# EAGLE design pga460_transformer (EAGLE 9.4.2)
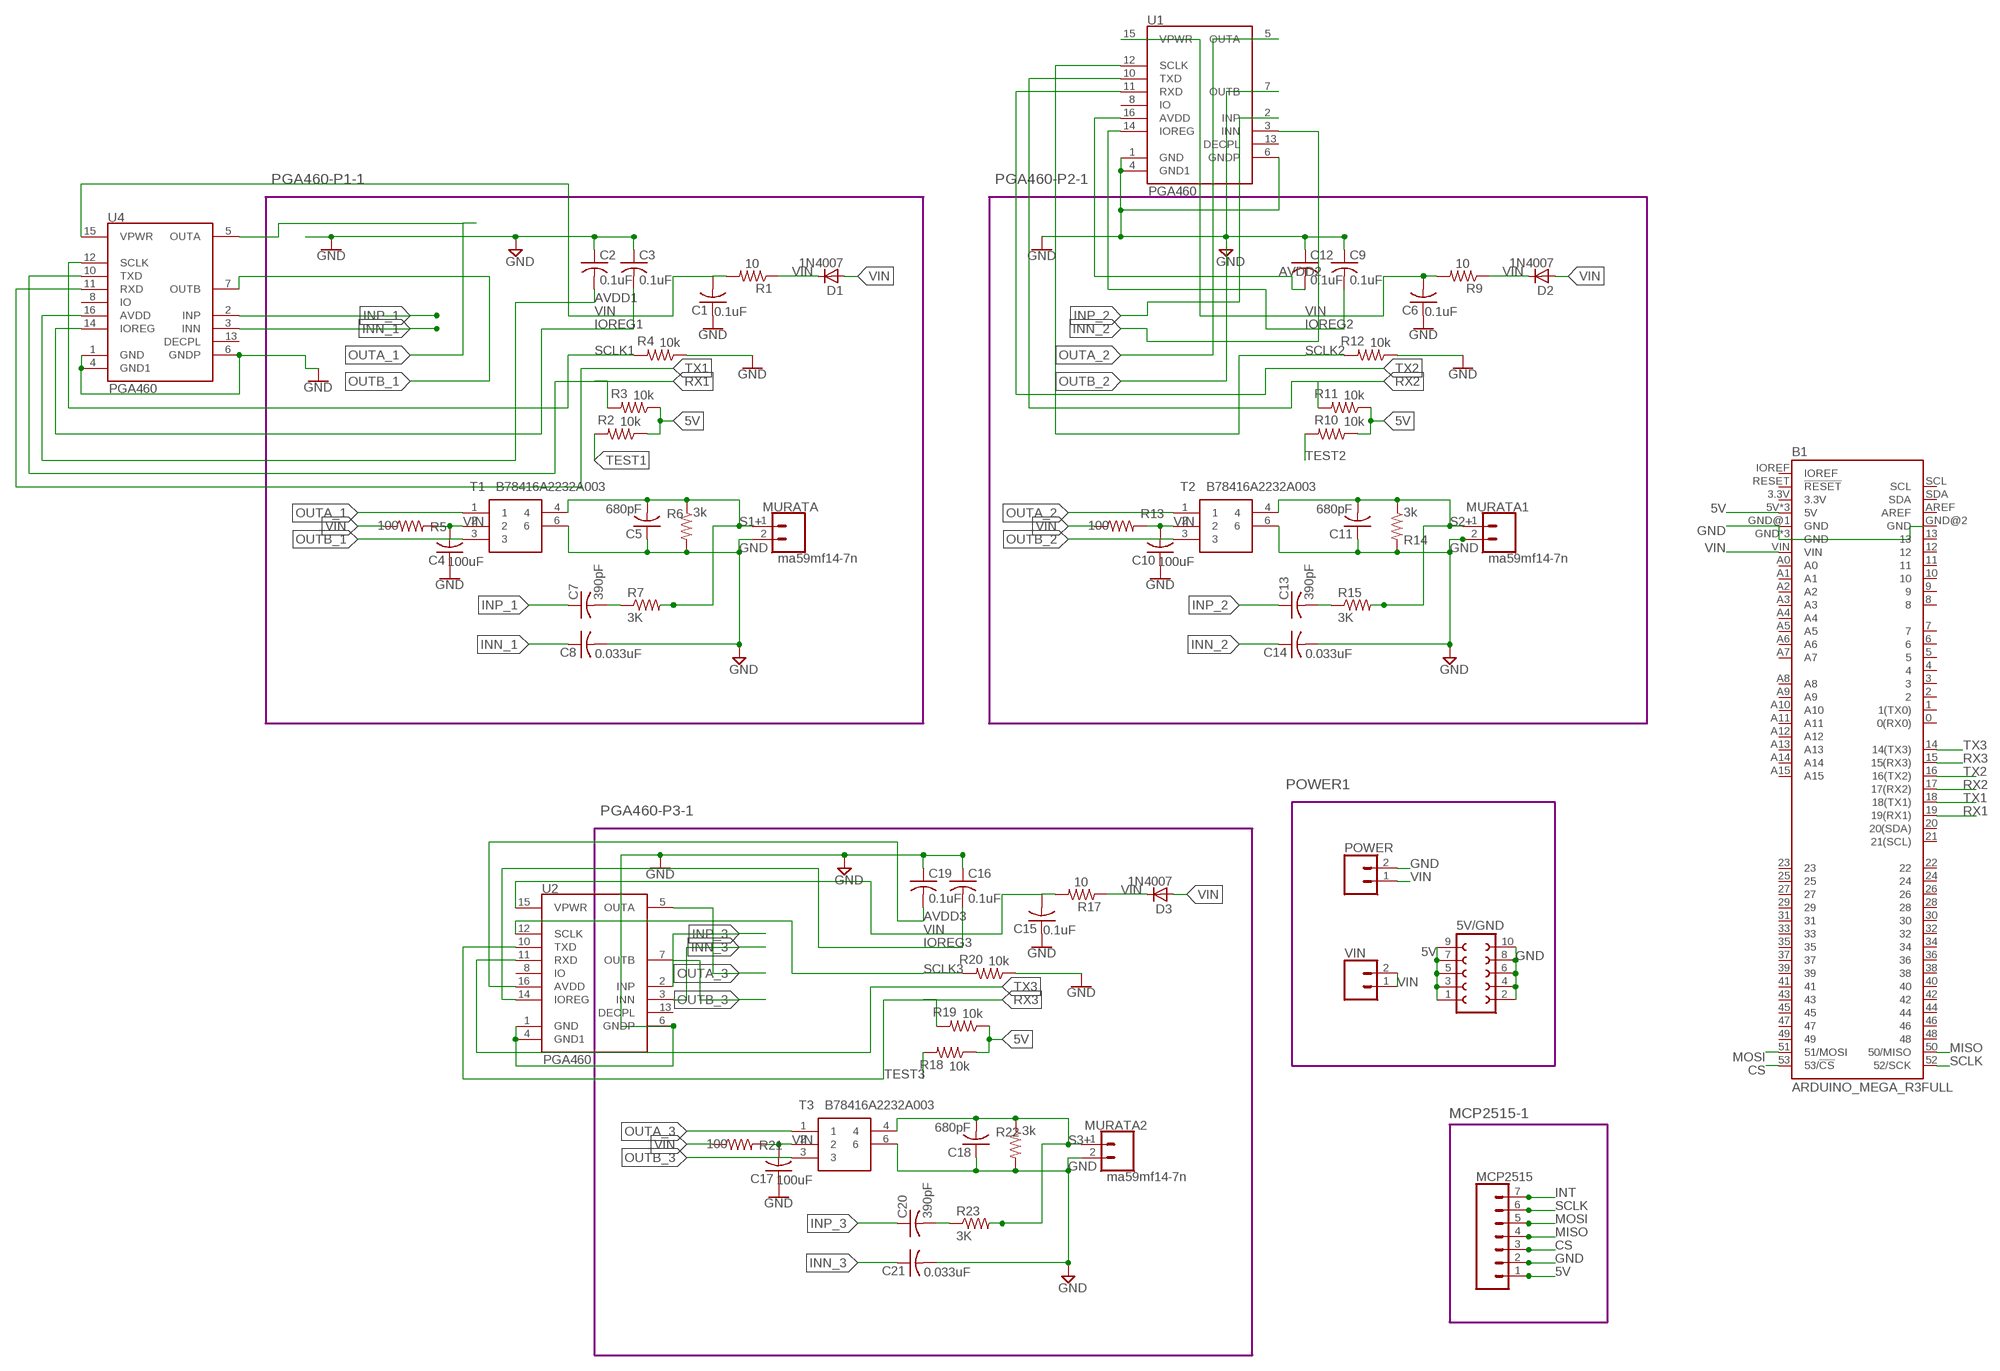
[diagram p0: schematic, sheet 1]

## Parts
5V/GND  FE05-2  [FE05-2]
B1  ARDUINO_MEGA_R3FULL  [ARDUINO_MEGA_NO_SILK]
C1  0.1uF  C-USC0805  [C0805]
C2  0.1uF  C-USC0805  [C0805]
C3  0.1uF  C-USC0805  [C0805]
C4  100uF  C-USC0805  [C0805]
C5  680pF  C-USC0805  [C0805]
C6  0.1uF  C-USC0805  [C0805]
C7  390pF  C-USC0805  [C0805]
C8  0.033uF  C-USC0805  [C0805]
C9  0.1uF  C-USC0805  [C0805]
C10  100uF  C-USC0805  [C0805]
C11  680pF  C-USC0805  [C0805]
C12  0.1uF  C-USC0805  [C0805]
C13  390pF  C-USC0805  [C0805]
C14  0.033uF  C-USC0805  [C0805]
C15  0.1uF  C-USC0805  [C0805]
C16  0.1uF  C-USC0805  [C0805]
C17  100uF  C-USC0805  [C0805]
C18  680pF  C-USC0805  [C0805]
C19  0.1uF  C-USC0805  [C0805]
C20  390pF  C-USC0805  [C0805]
C21  0.033uF  C-USC0805  [C0805]
D1  1N4007  [SMA]
D2  1N4007  [SMA]
D3  1N4007  [SMA]
MCP2515  CONN_07  [1X07]
MURATA  ma59mf14-7n  CONN_02  [1X02]
MURATA1  ma59mf14-7n  CONN_02  [1X02]
MURATA2  ma59mf14-7n  CONN_02  [1X02]
POWER  CONN_02  [1X02]
R1  10  R-US_R0805  [R0805]
R2  10k  R-US_R0805  [R0805]
R3  10k  R-US_R0805  [R0805]
R4  10k  R-US_R0805  [R0805]
R5  100  R-US_R0805  [R0805]
R6  3k  R-US_R0805  [R0805]
R7  3K  R-US_M0805  [M0805]
R9  10  R-US_R0805  [R0805]
R10  10k  R-US_R0805  [R0805]
R11  10k  R-US_R0805  [R0805]
R12  10k  R-US_R0805  [R0805]
R13  100  R-US_R0805  [R0805]
R14  3k  R-US_R0805  [R0805]
R15  3K  R-US_M0805  [M0805]
R17  10  R-US_R0805  [R0805]
R18  10k  R-US_R0805  [R0805]
R19  10k  R-US_R0805  [R0805]
R20  10k  R-US_R0805  [R0805]
R21  100  R-US_R0805  [R0805]
R22  3k  R-US_R0805  [R0805]
R23  3K  R-US_M0805  [M0805]
T1  B78416A2232A003  [B78416A2232A003]
T2  B78416A2232A003  [B78416A2232A003]
T3  B78416A2232A003  [B78416A2232A003]
U1  PGA460  [TSSOP16]
U2  PGA460  [TSSOP16]
U4  PGA460  [TSSOP16]
VIN  CONN_02  [1X02]

## Module instances
PGA460-P1-1 = PGA460-P1
PGA460-P2-1 = PGA460-P2
PGA460-P3-1 = PGA460-P3
POWER1 = POWER
MCP2515-1 = MCP2515

## Nets
5V: 5V/GND.1 5V/GND.3 5V/GND.5 5V/GND.7 5V/GND.9 B1.5V B1.5V@1(5V) B1.5V@2(5V) MCP2515.1 R2.1 R3.1 R10.1 R11.1 R18.1 R19.1
AVDD1: C2.2 U4.16(AVDD)
AVDD2: C12.2 U1.16(AVDD)
AVDD3: C19.2 U2.16(AVDD)
CS: B1.53(53/!CS) MCP2515.3
GND: 5V/GND.2 5V/GND.4 5V/GND.6 5V/GND.8 5V/GND.10 B1.GND B1.GND@1(GND) B1.GND@3(GND) B1.GND@4(GND) C1.1 C2.1 C3.1 C4.1 C5.1 C6.1 C8.2 C9.1 C10.1 C11.1 C12.1 C14.2 C15.1 C16.1 C17.1 C18.1 C19.1 C21.2 MCP2515.2 MURATA1.2 MURATA2.2 MURATA.2 POWER.2 R4.1 R6.2 R12.1 R14.2 R20.1 R22.2 T1.6 T2.6 T3.6 U1.1(GND) U1.4(GND1) U1.6(GNDP) U2.1(GND) U2.4(GND1) U2.6(GNDP) U4.1(GND) U4.4(GND1) U4.6(GNDP)
INN_1: C8.1 U4.3(INN)
INN_2: C14.1 U1.3(INN)
INN_3: C21.1 U2.3(INN)
INP_1: C7.1 U4.2(INP)
INP_2: C13.1 U1.2(INP)
INP_3: C20.1 U2.2(INP)
INT: MCP2515.7
IOREG1: C3.2 U4.14(IOREG)
IOREG2: C9.2 U1.14(IOREG)
IOREG3: C16.2 U2.14(IOREG)
MISO: B1.50(50/MISO) MCP2515.4
MOSI: B1.51(51/MOSI) MCP2515.5
N$10: C7.2 R7.1
N$12: C13.2 R15.1
N$18: C20.2 R23.1
OUTA_1: T1.1 U4.5(OUTA)
OUTA_2: T2.1 U1.5(OUTA)
OUTA_3: T3.1 U2.5(OUTA)
OUTB_1: T1.3 U4.7(OUTB)
OUTB_2: T2.3 U1.7(OUTB)
OUTB_3: T3.3 U2.7(OUTB)
RX1: B1.19(19(RX1)) R3.2 U4.10(TXD)
RX2: B1.17(17(RX2)) R11.2 U1.10(TXD)
RX3: B1.15(15(RX3)) R19.2 U2.10(TXD)
S1+: C5.2 MURATA.1 R6.1 R7.2 T1.4
S2+: C11.2 MURATA1.1 R14.1 R15.2 T2.4
S3+: C18.2 MURATA2.1 R22.1 R23.2 T3.4
SCLK: B1.52(52/SCK) MCP2515.6
SCLK1: R4.2 U4.12(SCLK)
SCLK2: R12.2 U1.12(SCLK)
SCLK3: R20.2 U2.12(SCLK)
TEST1: R2.2
TEST2: R10.2
TEST3: R18.2
TX1: B1.18(18(TX1)) U4.11(RXD)
TX2: B1.16(16(TX2)) U1.11(RXD)
TX3: B1.14(14(TX3)) U2.11(RXD)
VIN: B1.VIN C1.2 C4.2 C6.2 C10.2 C15.2 C17.2 D1.A D1.K(C) D2.A D2.K(C) D3.A D3.K(C) POWER.1 R1.1 R1.2 R5.1 R5.2 R9.1 R9.2 R13.1 R13.2 R17.1 R17.2 R21.1 R21.2 T1.2 T2.2 T3.2 U1.15(VPWR) U2.15(VPWR) U4.15(VPWR) VIN.1 VIN.2
Unconnected: B1.0(0(RX0)) B1.1(1(TX0)) B1.2 B1.3 B1.3.3V B1.4 B1.5 B1.6 B1.7 B1.8 B1.9 B1.10 B1.11 B1.12 B1.13 B1.20(20(SDA)) B1.21(21(SCL)) B1.22 B1.23 B1.24 B1.25 B1.26 B1.27 B1.28 B1.29 B1.30 B1.31 B1.32 B1.33 B1.34 B1.35 B1.36 B1.37 B1.38 B1.39 B1.40 B1.41 B1.42 B1.43 B1.44 B1.45 B1.46 B1.47 B1.48 B1.49 B1.A0 B1.A1 B1.A2 B1.A3 B1.A4 B1.A5 B1.A6 B1.A7 B1.A8 B1.A9 B1.A10 B1.A11 B1.A12 B1.A13 B1.A14 B1.A15 B1.AREF B1.GND@2(GND) B1.IOREF B1.RESET(!RESET) B1.SCL B1.SDA U1.8(IO) U1.13(DECPL) U2.8(IO) U2.13(DECPL) U4.8(IO) U4.13(DECPL)

## Library data of the parts
5V/GND = con-lsta:FE05-2: FEMALE HEADER; OC_FARNELL: unknown; OC_NEWARK: unknown
B1 = SparkFun-Boards:ARDUINO_MEGA_R3: Arduino Mega R3 ATmega2560 R3 compatible footprint. SparkFun Products: Arduino Mega 2560 R3 <https://www.sparkfun.com/products/11061>
C1-C21 = adafruit:C-US: CAPACITOR, American symbol
D1-D3 = casovac:1N4007
MCP2515 = SparkFun-Connectors:CONN_07: Multi connection point. Often used as Generic Header-pin footprint for 0.1 inch spaced/style header connections On any of the 0.1 inch spaced packages, you can populate with these: Break Away Headers - Straight <https://www.sparkfun.com/products/116> (PRT-00116) Break Away Male Headers - Right Angle <https://www.sparkfun.com/products/553> (PRT-00553) Female Headers <https://www.sparkfun.com/products/115> (PRT-00115) Break Away Headers - Machine Pin <https://www.sparkfun.com/products/117> (PRT-00117) Break Away Female Headers - Swiss Machine Pin <https://www.sparkfun.com/products/743> (PRT-00743) For SCREWTERMINALS and SPRING TERMINALS visit here: Screw Terimnals on SparkFun.com <https://www.sparkfun.com/search/results?term=Screw+Terminals> (5mm/3.5mm/2.54mm spacing) This device is also useful as a general connection point to wire up your design to another part of your project. Our various solder wires solder well into these plated through hole pads. Hook-Up Wire - Assortment (Stranded, 22 AWG) <https://www.sparkfun.com/products/11375> (PRT-11375) Hook-Up Wire - Assortment (Solid Core, 22 AWG) <https://www.sparkfun.com/products/11367> (PRT-11367) View the entire wire category on our website here <https://www.sparkfun.com/categories/141> Special notes: Molex polarized connector foot print use with SKU : PRT-08231 with associated crimp pins and housings. 1MM SMD Version SKU: PRT-10208 NOTES ON THE VARIANTS LOCK and LOCK_LONGPADS... This footprint was designed to help hold the alignment of a through-hole component (i.e. 6-pin header) while soldering it into place. You may notice that each hole has been shifted either up or down by 0.005 of an inch from it's more standard position (which is a perfectly straight line). This slight alteration caused the pins (the squares in the middle) to touch the edges of the holes. Because they are alternating, it causes a "brace" to hold the component in place. 0.005 has proven to be the perfect amount of "off-center" position when using our standard breakaway headers. Although looks a little odd when you look at the bare footprint, once you have a header in there, the alteration is very hard to notice. Also,if you push a header all the way into place, it is covered up entirely on the bottom side.
MURATA MURATA1 MURATA2 POWER VIN = SparkFun-Connectors:CONN_02: Multi connection point. Often used as Generic Header-pin footprint for 0.1 inch spaced/style header connections On any of the 0.1 inch spaced packages, you can populate with these: Break Away Headers - Straight <https://www.sparkfun.com/products/116> (PRT-00116) Break Away Male Headers - Right Angle <https://www.sparkfun.com/products/553> (PRT-00553) Female Headers <https://www.sparkfun.com/products/115> (PRT-00115) Break Away Headers - Machine Pin <https://www.sparkfun.com/products/117> (PRT-00117) Break Away Female Headers - Swiss Machine Pin <https://www.sparkfun.com/products/743> (PRT-00743) For SCREWTERMINALS and SPRING TERMINALS visit here: Screw Terimnals on SparkFun.com <https://www.sparkfun.com/search/results?term=Screw+Terminals> (5mm/3.5mm/2.54mm spacing) This device is also useful as a general connection point to wire up your design to another part of your project. Our various solder wires solder well into these plated through hole pads. Hook-Up Wire - Assortment (Stranded, 22 AWG) <https://www.sparkfun.com/products/11375> (PRT-11375) Hook-Up Wire - Assortment (Solid Core, 22 AWG) <https://www.sparkfun.com/products/11367> (PRT-11367) View the entire wire category on our website here <https://www.sparkfun.com/categories/141> Special notes: Molex polarized connector foot print use with: PRT-08233 with associated crimp pins and housings. 2.54_SCREWTERM for use with PRT-10571. 3.5mm Screw Terminal footprints for PRT-08084 5mm Screw Terminal footprints for use with PRT-08432
R1-R6 R9-R14 R17-R22 = adafruit:R-US_: RESISTOR, American symbol
R7 R15 R23 = rcl:R-US_: RESISTOR, American symbol; SPICEPREFIX: R
T1-T3 = SamacSys_Parts:B78416A2232A003: Current Transformers 3mH 52KHz 200Vac XFMR Ultrasonic Snsr Source: Datasheet <https://componentsearchengine.com/Datasheets/1/B78416A2232A003.pdf>; DESCRIPTION: Current Transformers 3mH 52KHz 200Vac XFMR Ultrasonic Snsr; HEIGHT: 7.1mm; MANUFACTURER_NAME: EPCOS; MANUFACTURER_PART_NUMBER: B78416A2232A003; MOUSER_PART_NUMBER: 871-B78416A2232A003; MOUSER_PRICE-STOCK: https://www.mouser.com/Search/Refine.aspx?Keyword=871-B78416A2232A003
U1 U2 U4 = texas:PGA460: PGA460 Ultrasonic Signal Processor and Transducer Driver

## Module PGA460-P1
Ports: 

### Library data of the parts

## Module PGA460-P2
Ports: 

### Library data of the parts

## Module PGA460-P3
Ports: 

### Library data of the parts

## Module POWER
Ports: 

### Library data of the parts

## Module MCP2515
Ports: 

### Library data of the parts

## Board
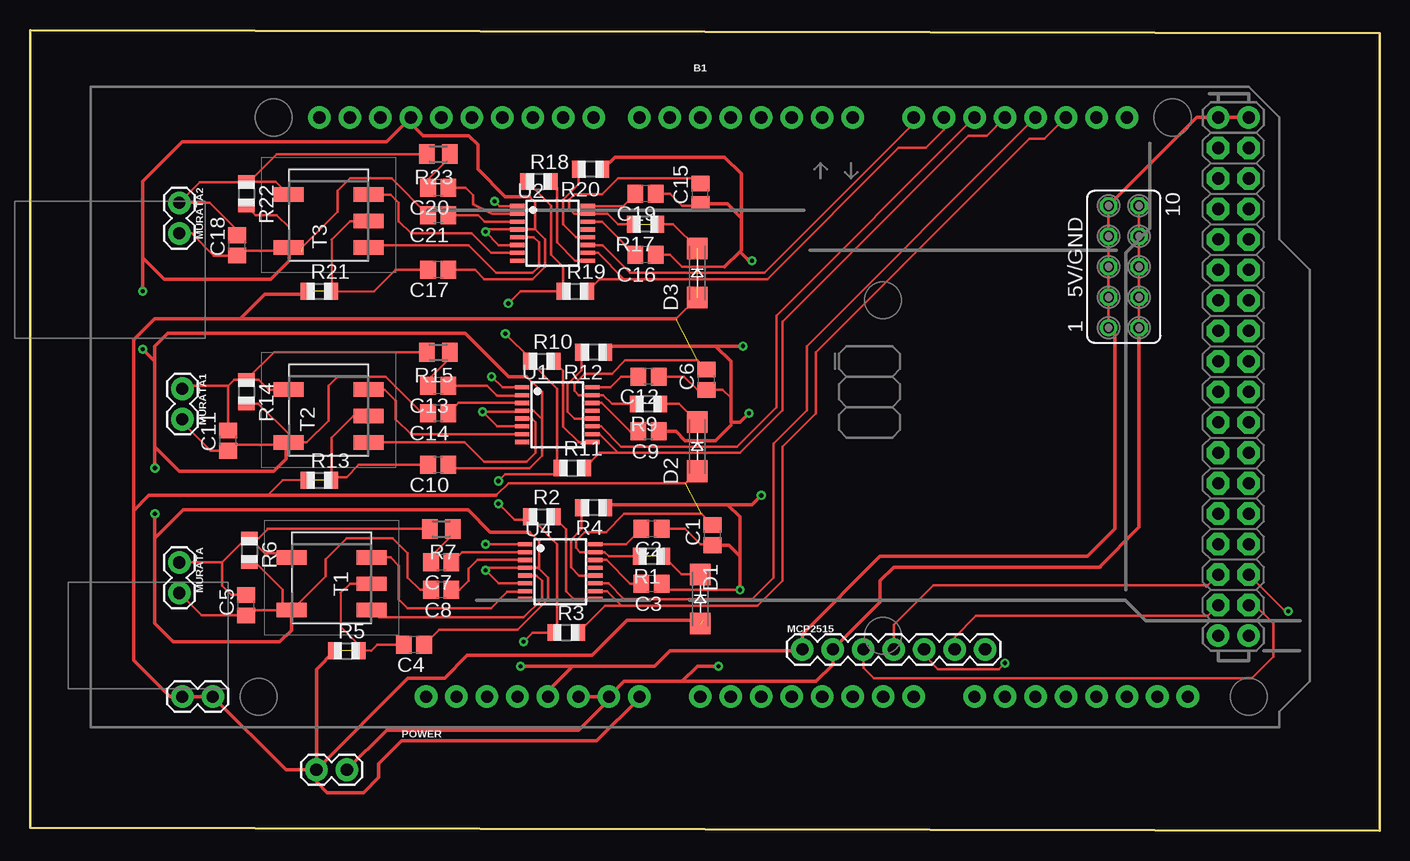
[diagram p1: board, top side]
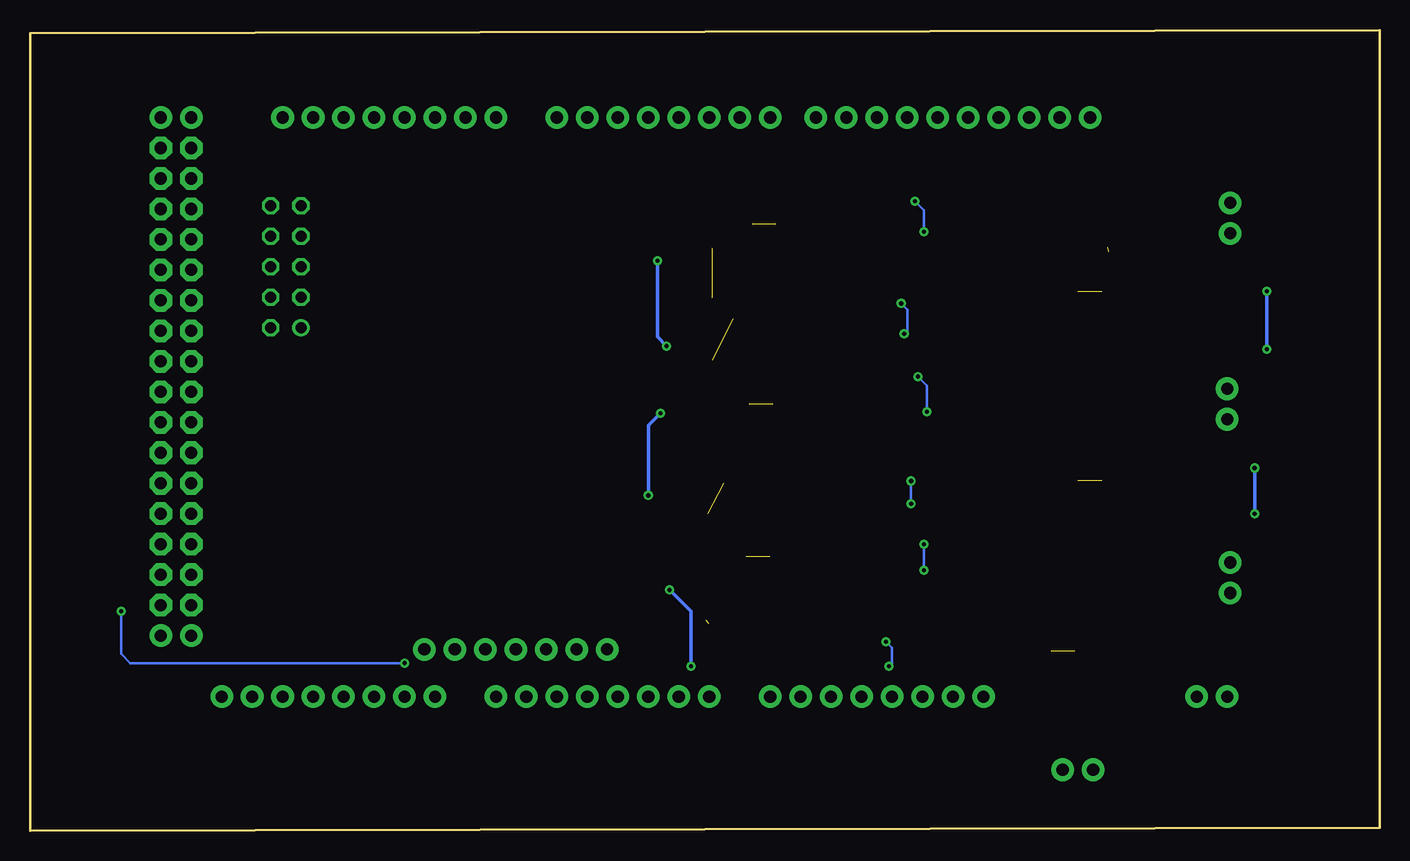
[diagram p2: board, bottom side, seen from below]

Size 112.5 x 66.73 mm. Coordinates in mm from the lower left corner, seen from the top.
Outline: 0,0.25 112.5,0 112.5,66.47 0,66.73 0,0.25
Copper layers (1*16): Top 0.035mm / dielectric 1.5mm / Bottom 0.035mm
Design rules "default": minimum track width 6mil, minimum drill 0.35mm, track to track 6mil, track to pad 6mil, pad to pad 6mil, via to via 6mil, smd to smd 6mil, copper to edge 40mil, drill to drill 6mil, minimum pad ring 10mil, minimum via ring 8mil, stop-mask expansion 4mil, vias tented up to drill 0mil, thermal gap 10mil

### Footprints (pad centres in the part's own frame; a part is rotated, then mirrored left to right if it is on the bottom)
FE05-2 = drill 0.914: 1 -5.08,1.27 | drill 0.914 octagon: 2 -5.08,-1.27; 3 -2.54,1.27; 4 -2.54,-1.27; 5 0,1.27; 6 0,-1.27; 7 2.54,1.27; 8 2.54,-1.27; 9 5.08,1.27; 10 5.08,-1.27
ARDUINO_MEGA_NO_SILK = drill 1.016 pad 1.88: 0 13.97,24.13; 1 11.43,24.13; 2 8.89,24.13; 3 6.35,24.13; 3.3V -13.97,-24.13; 4 3.81,24.13; 5 1.27,24.13; 5V -11.43,-24.13; 5V@1 44.45,24.13; 5V@2 46.99,24.13; 6 -1.27,24.13; 7 -3.81,24.13; 8 -7.62,24.13; 9 -10.16,24.13; 10 -12.7,24.13; 11 -15.24,24.13; 12 -17.78,24.13; 13 -20.32,24.13; 14 19.05,24.13; 15 21.59,24.13; 16 24.13,24.13; 17 26.67,24.13; 18 29.21,24.13; 19 31.75,24.13; 20 34.29,24.13; 21 36.83,24.13; A0 1.27,-24.13; A1 3.81,-24.13; A2 6.35,-24.13; A3 8.89,-24.13; A4 11.43,-24.13; A5 13.97,-24.13; A6 16.51,-24.13; A7 19.05,-24.13; A8 24.13,-24.13; A9 26.67,-24.13; A10 29.21,-24.13; A11 31.75,-24.13; A12 34.29,-24.13; A13 36.83,-24.13; A14 39.37,-24.13; A15 41.91,-24.13; AREF -25.4,24.13; GND -8.89,-24.13; GND@1 -6.35,-24.13; GND@2 44.45,-19.05; GND@3 46.99,-19.05; GND@4 -22.86,24.13; IOREF -19.05,-24.13; NC -21.59,-24.13; RESET -16.51,-24.13; SCL -30.48,24.13; SDA -27.94,24.13; VIN -3.81,-24.13 | drill 1.016 pad 1.88 octagon: 22 44.45,21.59; 23 46.99,21.59; 24 44.45,19.05; 25 46.99,19.05; 26 44.45,16.51; 27 46.99,16.51; 28 44.45,13.97; 29 46.99,13.97; 30 44.45,11.43; 31 46.99,11.43; 32 44.45,8.89; 33 46.99,8.89; 34 44.45,6.35; 35 46.99,6.35; 36 44.45,3.81; 37 46.99,3.81; 38 44.45,1.27; 39 46.99,1.27; 40 44.45,-1.27; 41 46.99,-1.27; 42 44.45,-3.81; 43 46.99,-3.81; 44 44.45,-6.35; 45 46.99,-6.35; 46 44.45,-8.89; 47 46.99,-8.89; 48 44.45,-11.43; 49 46.99,-11.43; 50 44.45,-13.97; 51 46.99,-13.97; 52 44.45,-16.51; 53 46.99,-16.51
C0805 = smd 1.3 x 1.5: 1 -0.85,0; 2 0.85,0
SMA = smd 1.8 x 1.7: A -2.05,0; K 2.05,0
1X07 = drill 1.016 pad 1.88: 1 0,0; 2 2.54,0; 3 5.08,0; 4 7.62,0; 5 10.16,0; 6 12.7,0; 7 15.24,0
1X02 = drill 1.016 pad 1.88: 1 0,0; 2 2.54,0
R0805 = smd 1.1 x 1.4: 1 -1,0; 2 1,0
M0805 = smd 1.3 x 1.6: 1 -0.95,0; 2 0.95,0
B78416A2232A003 = smd 1.2 x 2.5: 1 -2.7,-3.35; 2 -0.5,-3.35; 3 1.7,-3.35; 4 1.7,3.35; 6 -2.7,3.35
TSSOP16 = smd 0.35 x 1.2: 1 -2.275,-2.925; 2 -1.625,-2.925; 3 -0.975,-2.925; 4 -0.325,-2.925; 5 0.325,-2.925; 6 0.975,-2.925; 7 1.625,-2.925; 8 2.275,-2.925; 9 2.275,2.925; 10 1.625,2.925; 11 0.975,2.925; 12 0.325,2.925; 13 -0.325,2.925; 14 -0.975,2.925; 15 -1.625,2.925; 16 -2.275,2.925

### Placement (x,y rotation side)
5V/GND  91.19,46.99 90 top
B1  54.61,35.31 0 top
C1  56.9,24.64 90 top
C2  51.82,25.15 180 top
C3  51.82,20.57 180 top
C4  32,15.49 180 top
C5  18.03,18.8 90 top
C6  56.39,37.59 90 top
C7  34.29,22.35 180 top
C8  34.29,20.07 180 top
C9  51.56,33.27 180 top
C10  34.04,30.48 180 top
C11  16.51,32.51 90 top
C12  51.56,37.85 180 top
C13  34.04,37.08 180 top
C14  34.04,34.8 180 top
C15  55.88,53.09 90 top
C16  51.31,48.01 180 top
C17  34.04,46.74 180 top
C18  17.27,48.77 90 top
C19  51.31,53.09 180 top
C20  34.04,53.59 180 top
C21  34.04,51.31 180 top
D1  55.88,19.3 90 top
D2  55.63,32 90 top
D3  55.63,46.48 90 top
MCP2515  64.39,15.11 0 top
MURATA  12.45,22.35 270 top
MURATA1  12.7,36.83 270 top
MURATA2  12.45,52.32 270 top
POWER  23.88,5.08 0 top
R1  51.82,22.86 180 top
R2  42.67,26.16 0 top
R3  44.7,16.51 0 top
R4  46.99,26.92 180 top
R5  26.42,14.99 0 top
R6  18.29,23.37 270 top
R7  34.29,25.15 180 top
R9  51.56,35.56 180 top
R10  42.67,39.12 0 top
R11  45.21,30.23 0 top
R12  46.99,39.88 180 top
R13  24.13,29.21 0 top
R14  18.03,36.58 270 top
R15  34.04,39.88 180 top
R17  51.31,50.55 180 top
R18  42.42,54.1 0 top
R19  45.47,44.96 0 top
R20  46.74,55.12 180 top
R21  24.13,44.96 0 top
R22  18.03,53.09 270 top
R23  34.04,56.39 180 top
T1  25.15,21.08 90 top
T2  24.89,35.05 90 top
T3  24.89,51.31 90 top
U1  43.94,34.67 270 top
U2  43.56,49.78 270 top
U4  44.2,21.59 270 top
VIN  15.24,11.18 180 top

### Tracks (layer width: path | path; a pad name or v marks a point on that pad's centre or on a via)
5V  (via drill 0.35)
  Top 0.203: 54.63,14.99 54.1,14.99 | 45.72,13.72 45.21,13.72 | 43.18,11.68 B1.5V | R10.1 41.67,38.85 | R2.1 41.67,26.15 | 41.67,26.15 43.96,23.86 43.96,16.76 R3.1 41.91,16.51 v41.15,15.75 | R18.1 43.43,52.09 43.43,48.01 44.45,46.99 44.45,44.96 | 5V/GND.9 5V/GND.7 5V/GND.5 5V/GND.3 5V/GND.1 90.42,41.4 | R10.1 43.94,36.85 43.94,30.5 R11.1 43.7,29.72 39.62,29.72 v39.05,29.14 | v39.05,27.24 40.39,25.91 41.43,25.91 41.67,26.15 | v39.88,43.94 40.89,44.96 44.45,44.96 | R19.1 44.45,44.96 | v39.62,41.42 41.67,39.37 R10.1
  Top 0.305: 45.21,13.72 43.18,11.68 | 90.42,41.4 90.42,25.15 88.14,22.86 70.87,22.86 64.39,16.38 MCP2515.1 64.26,14.99 54.1,14.99 53.34,14.99 52.07,13.72 45.72,13.72 v40.89,13.72 | B1.5V@2 B1.5V@1 97.28,59.44 5V/GND.9
  Bottom 0.203: v41.15,15.75 40.64,15.24 40.64,13.97 v40.89,13.72 | v39.05,29.14 v39.05,27.24 | v39.88,43.94 39.37,43.43 39.37,41.67 v39.62,41.42
AVDD1
  Top 0.203: C2.2 49.69,23.87 U4.16
AVDD2
  Top 0.203: U1.16 48.38,36.95 49.28,37.85 C12.2
AVDD3
  Top 0.203: C19.2 49.43,52.06 U2.16
CS
  Top 0.203: B1.53 102.11,18.8 103.63,17.27 103.63,14.48 101.85,12.7 70.36,12.7 69.47,13.59 MCP2515.3
GND  (via drill 0.35)  (1 unrouted)
  Top 0.203: 48.26,10.92 B1.GND@1 | 52.82,25.3 C2.1 54.61,25.15 55.88,23.88 56.81,23.88 C1.1 | C3.1 53.17,20.07 v59.18,20.07 | R12.1 48.5,40.39 | C12.1 54.52,37.85 55.63,36.74 C6.1 57.75,36.74 58.42,36.07 | C16.1 53.34,48.01 54.36,46.99 57.91,46.99 | 58.42,33.78 58.42,34.04 | 5V/GND.10 5V/GND.8 5V/GND.6 5V/GND.4 5V/GND.2 | C19.1 53.34,53.09 54.36,52.07 55.71,52.07 C15.1 | 59.18,48.26 59.31,48.39 | 89.15,21.97 89.28,21.97 | C17.1 37.08,46.74 37.85,45.97 41.91,45.97 42.93,46.99 42.93,49.28 42.09,50.11 | C10.1 35.14,30.23 41.66,30.23 42.67,31.24 42.67,34.29 | R4.1 48.24,27.18 | C4.1 34.12,16.76 40.64,16.76 43.18,19.3 43.18,21.08 42.42,21.84 | 59.94,47.5 v60.2,47.5 | 41.66,52.83 42.09,52.4 42.09,50.11 | 41.4,37.85 42.67,36.58 42.67,34.29 | 42.42,21.84 42.42,21.97 | 42.42,21.97 42.42,24.13 41.66,24.89 | MURATA2.2 13.46,49.78 15.33,47.92 C18.1 17.68,48.33 21.27,48.33 T3.6 | 22.35,48.26 22.1,48.26 22.1,48.51 22.35,48.26 | 22.35,48.26 22.61,48.26 | R22.2 18.81,51.31 20.57,51.31 21.59,50.29 21.59,48.61 | C21.2 30.14,54.36 26.67,54.36 25.65,53.34 25.65,51.56 22.7,48.61 21.59,48.61 | R14.2 19.03,35.58 21.54,33.07 T2.6 | T2.6 21.36,32.17 21.34,32.17 17.02,32.17 C11.1 15.07,31.66 12.7,34.04 MURATA1.2 | T2.6 23.07,32.35 24.89,34.18 24.89,37.08 25.65,37.85 29.63,37.85 32.68,34.8 C14.2 | 21.08,18.38 18.64,18.38 18.12,17.86 C5.1 14.31,17.95 MURATA.2 | 21.08,18.38 T1.6 24.64,21.22 24.64,22.61 26.42,24.38 30.23,24.38 31.5,23.11 31.5,21.08 32.51,20.07 C8.2 | R6.2 18.78,22.37 21.08,20.07 21.08,18.38 | T3.6 21.54,48.26 21.59,48.31 21.59,48.61 | T3.6 21.59,48.61 | 42.35,21.92 42.42,21.84 | U4.1 37.98,23.87 v37.97,23.88
  Top 0.203: U4.6 39.08,20.62 v37.97,21.72 38.17,21.92 U4.4 42.36,21.92 42.42,21.97 | 42.09,50.11 U2.4 38.17,50.11 v37.97,49.91 39.08,48.81 U2.6 | U2.1 39.13,52.06 v38.73,52.45 | U1.4 41.15,35 | 41.15,35 41.97,35 42.67,34.29 | U1.1 39.38,36.95 v38.48,37.85 | 41.15,35 41.08,34.93 v37.72,34.93 38.95,33.7 U1.6
  Top 0.305: POWER.2 29.72,8.38 45.72,8.38 48.26,10.92 | 54.36,12.45 65.53,12.45 66.93,13.84 MCP2515.2 70.87,19.05 70.87,20.83 72.01,21.97 89.15,21.97 92.46,25.27 5V/GND.2 | 54.36,12.45 49.53,12.45 B1.GND@1 B1.GND | 57.15,40.39 48.5,40.39 | 57.15,40.39 58.42,39.12 58.42,36.07 58.42,34.04 59.18,34.04 v59.94,34.8 | C9.1 53.85,33.27 54.61,32.51 57.15,32.51 58.42,33.78 | R20.1 48.75,56.13 57.91,56.13 59.31,54.74 59.31,51.05 | 59.31,48.39 59.31,51.05 | 57.91,46.99 59.18,48.26 59.94,47.5 | C15.1 58.13,52.24 59.31,51.05 | 58.17,27.18 59.18,26.16 59.18,22.86 | 48.24,27.18 58.17,27.18 | v60.96,27.94 60.2,27.18 58.17,27.18 | v59.44,40.39 57.15,40.39 | 9.4,47.75 9.4,54.1 12.7,57.4 29.72,57.4 B1.GND@4 31.75,58.93 32.77,57.91 36.58,57.91 37.34,57.15 37.34,55.12 39.62,52.83 41.66,52.83 | v9.4,44.96 9.4,47.75 | v9.4,40.13 10.41,39.12 | 10.41,39.12 10.41,32 | 10.41,32 v10.41,30.23 | v10.41,26.42 10.41,24.38 | 10.41,24.38 10.41,17.27 11.94,15.75 20.83,15.75 21.8,16.72 T1.6 | 10.41,24.38 12.77,26.74 36.51,26.74 38.35,24.89 41.66,24.89 | 10.41,39.12 10.41,40.39 11.5,41.47 36.26,41.47 39.88,37.85 41.4,37.85 | 10.41,32 12.45,29.97 20.32,29.97 21.34,30.99 21.34,32.17 | 9.4,47.75 11.18,45.97 20.07,45.97 21.59,47.5 21.59,48.31 | 54.36,12.45 55.63,13.72 v57.4,13.72 | 59.18,22.86 v59.18,20.07 | 59.18,22.86 58.25,23.79 C1.1
  Bottom 0.203: v37.97,23.88 v37.97,21.72 | v38.73,52.45 37.97,51.69 v37.97,49.91 | v38.48,37.85 37.72,37.08 v37.72,34.93
  Bottom 0.305: v59.94,34.8 60.96,33.78 v60.96,27.94 | v60.2,47.5 60.2,41.15 v59.44,40.39 | v9.4,44.96 v9.4,40.13 | v10.41,30.23 v10.41,26.42 | v57.4,13.72 57.4,18.29 v59.18,20.07
INN_1
  Top 0.203: C8.1 35.81,20.07 36.58,20.83 36.58,21.84 37.3,22.57 U4.3
INN_2
  Top 0.203: U1.3 35.73,35.65 C14.1
INN_3
  Top 0.203: C21.1 37.34,51.31 37.89,50.76 U2.3
INP_1
  Top 0.203: C7.1 36,23.22 U4.2
INP_2
  Top 0.203: C13.1 38.1,37.08 38.89,36.3 38.92,36.26 40.98,36.26 U1.2
INP_3
  Top 0.203: C20.1 36.32,53.59 36.96,52.96 36.96,52.2 38.51,51.41 U2.2
IOREG1
  Top 0.203: C3.2 50.04,20.57 48.05,22.57 U4.14
IOREG2
  Top 0.203: C9.2 50.04,33.27 47.67,35.65 U1.14
IOREG3
  Top 0.203: C16.2 47.7,50.76 U2.14
MISO
  Top 0.203: B1.50 98.17,20.45 | 98.17,20.45 98.04,20.32 | MCP2515.4 72.01,17.15 75.31,20.45 98.17,20.45
MOSI  (via drill 0.35)
  Top 0.203: B1.51 104.65,18.29 v104.9,18.29 | v81.28,13.97 80.77,13.46 75.69,13.46 74.68,14.48 74.68,14.99 MCP2515.5
  Bottom 0.203: v104.9,18.29 104.9,14.73 104.14,13.97 v81.28,13.97 81.03,13.97
N$1
  Top 0.203: 45.47,47.5 46.74,47.5
N$2
  Top 0.203: 45.72,32.39 47.12,32.39
N$10
  Top 0.203: C7.2 33.44,22.86 35.24,24.66 R7.1
N$12
  Top 0.203: C13.2 33.19,37.57 34.99,39.37 R15.1
N$18
  Top 0.203: C20.2 33.19,54.27 34.99,56.07 R23.1
OUTA_1
  Top 0.203: T1.1 29.1,17.78 41.15,17.78 42.67,19.3 42.67,20.83 42.23,21.27 U4.5
OUTA_2
  Top 0.203: T2.1 36.23,32.35 37.85,30.73 41.4,30.73 42.16,31.5 42.16,34.04 41.85,34.35 U1.5
OUTA_3
  Top 0.203: T3.1 28.4,48.77 36.58,48.77 38.86,46.48 41.91,46.48 42.42,46.99 42.42,49.02 41.98,49.46 U2.5
OUTB_1
  Top 0.203: T1.3 30.05,22.78 30.73,22.1 30.73,19.3 31.5,18.54 38.44,18.54 39.79,19.9 41.2,19.9 U4.7
OUTB_2
  Top 0.203: 28.39,36.91 T2.3 29.54,36.75 30.48,35.81 30.48,34.29 31.75,33.02 40.39,33.02 40.71,33.02 40.99,33.02 U1.7
OUTB_3
  Top 0.203: T3.3 30.05,53.01 30.73,52.32 30.73,50.8 31.75,49.78 36.83,49.78 38.45,48.16 U2.7
RX1
  Top 0.203: 49.33,18.75 60.66,18.75 62.74,20.83 62.74,32 65.53,34.8 65.53,39.88 83.31,57.66 84.58,57.66 B1.19 | 49.33,18.75 48.11,19.97 U4.10 | 49.33,18.75 47.94,18.75 R3.2
RX2
  Top 0.203: 49.02,31.5 59.18,31.5 62.74,35.05 62.74,42.42 78.23,57.91 79.76,57.91 B1.17 | R11.2 47.48,31.5 49.02,31.5 | U1.10 47.47,33.05 49.02,31.5
RX3
  Top 0.203: 49.53,45.97 47.34,48.16 U2.10 | 49.53,45.97 61.47,45.97 72.39,56.9 74.68,56.9 76.2,58.42 B1.15 | R19.2 47.48,45.97 49.53,45.97
S1+
  Top 0.203: 18.3,24.37 R6.1 18.02,24.37 16,22.35 | 18.3,24.37 19.07,24.37 19.81,25.11 19.81,25.15 R7.2 | 18.3,24.37 19.56,23.11 21.46,23.11 T1.4 | C5.2 16.76,19.65 16,20.41 16,22.35 | MURATA.1 16,22.35
S2+
  Top 0.203: R14.1 19.07,37.58 19.89,36.75 T2.4 | MURATA1.1 12.94,37.07 16.51,37.07 | R15.2 20.34,39.88 R14.1 | 16.51,37.07 17.02,37.58 R14.1 | 16.51,37.07 C11.2
S3+
  Top 0.203: R22.1 18.29,54.09 | 18.29,54.09 20.46,54.09 T3.4 | R23.2 24.92,56.39 20.57,56.39 18.22,54.03 | 18.22,54.03 14.15,54.03 MURATA2.1 12.95,52.83 12.97,52.83 12.46,52.32 14.99,52.32 17.27,50.04 C18.2 | 18.22,54.03 18.23,54.03 18.29,54.09
SCLK
  Top 0.203: B1.52 98.17,17.91 78.87,17.91 77.09,16.13 MCP2515.6
SCLK1
  Top 0.203: R4.2 45.99,25.16 45.09,24.26 45.09,21.97 45.79,21.27 U4.12
SCLK2
  Top 0.203: R12.2 45.99,38.37 44.83,37.21 44.83,34.93 45.41,34.35 U1.12
SCLK3
  Top 0.203: R20.2 45.74,53.86 44.45,52.58 44.45,50.55 45.54,49.46 U2.12
TEST1
  Top 0.203: R2.2 44.7,25.13 44.7,19.94 45.34,19.3 47.37,19.3
TEST2
  Top 0.203: R10.2 44.45,38.34 44.45,33.66 45.71,32.4
TEST3
  Top 0.203: R18.2 43.93,53.59 43.93,49.04 45.45,47.51
TX1
  Top 0.203: B1.18 64.77,40.39 64.77,35.05 61.98,32.26 61.98,21.08 60.2,19.3 49.53,19.3 48.22,20.62 U4.11
TX2
  Top 0.203: B1.16 62.23,42.93 62.23,35.31 58.93,32 49.28,32 47.58,33.7 U1.11
TX3
  Top 0.203: B1.14 73.66,58.93 61.21,46.48 50.04,46.48 47.71,48.81 U2.11
VIN  (10 unrouted)
  Top 0.152: 25.91,19.81 25.91,17 27.42,15.49 R5.2 28.45,14.99 | R13.1 21.08,29.21 | 28.7,44.96 R21.2 25.13,49.26
  Top 0.203: R1.2 48.26,22.86 47.91,23.22 U4.15 45.87,23.22 45.52,23.57 45.52,24.18 46.23,24.89 48.01,24.89 49.53,26.42 55.97,26.42 C1.2 | T1.2 26.68,20.58 25.91,19.81 | C4.2 28.96,15.49 28.45,14.99 | C6.2 55.63,39.2 49.62,39.2 48.51,38.1 46.23,38.1 45.39,37.26 45.39,36.65 45.75,36.3 U1.15 47.78,36.3 48.51,35.56 R9.2 | C10.2 27.42,30.48 26.4,29.46 25.15,29.46 | T2.2 26.93,34.55 25.15,32.77 25.15,29.46 | R17.2 49.02,50.55 48.16,51.41 U2.15 45.37,51.41 44.96,51.82 44.96,52.58 45.41,53.04 47.7,53.04 49.02,54.36 55.46,54.36 C15.2 | T3.2 26.68,50.81 25.13,49.26 | C17.2 30.48,46.74 28.7,44.96 | VIN.2 11.68,11.18 | 21.08,29.21 19.81,27.94 | 38.86,27.94 39.88,28.96 54.63,28.96 D2.A | 53.87,42.67 D3.A | D1.K 54.32,21.35 R1.1 | R17.1 53.61,50.55 D3.K | R9.1 54.12,35.56 D2.K | 25.15,29.46 25.15,29.21 R13.2 | R21.1 22.88,44.7
  Top 0.305: POWER.1 21.34,5.08 VIN.1 VIN.2 | POWER.1 31.5,12.7 34.54,12.7 36.45,14.61 46.86,14.61 49.78,17.53 56.13,17.53 | 8.64,26.67 8.64,14.22 11.68,11.18 | 8.64,26.67 8.64,40.89 10.41,42.67 17.53,42.67 | 8.64,26.67 9.91,27.94 19.81,27.94 38.86,27.94 | 17.53,42.67 53.87,42.67 | 17.53,42.67 19.56,44.7 22.88,44.7 | POWER.1 23.88,13.45 R5.1 | POWER.1 23.88,4.06 24.77,3.18 27.81,3.18 29.08,4.45 29.08,5.59 30.99,7.49 47.24,7.49 50.8,11.05 B1.VIN